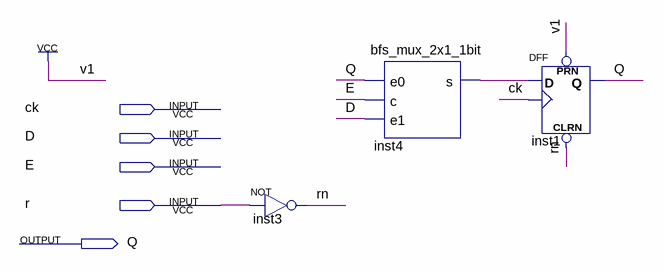
[diagram p0: schematic sheet]
// Quartus schematic bfs_ffEnable.bdf as structural Verilog: 3 symbols, 5 pins
module bfs_ffEnable (
  input  ck,
  input  D,
  input  E,
  input  r,
  output Q
);

  wire inst4_s, rn;

  not inst3 (rn, r);
  bfs_mux_2x1_1bit inst4 (.e0(Q), .c(E), .e1(D), .s(inst4_s));
  DFF inst1 (.CLRN(rn), .CLK(ck), .D(inst4_s), .PRN(1'b1), .Q(Q));
endmodule
